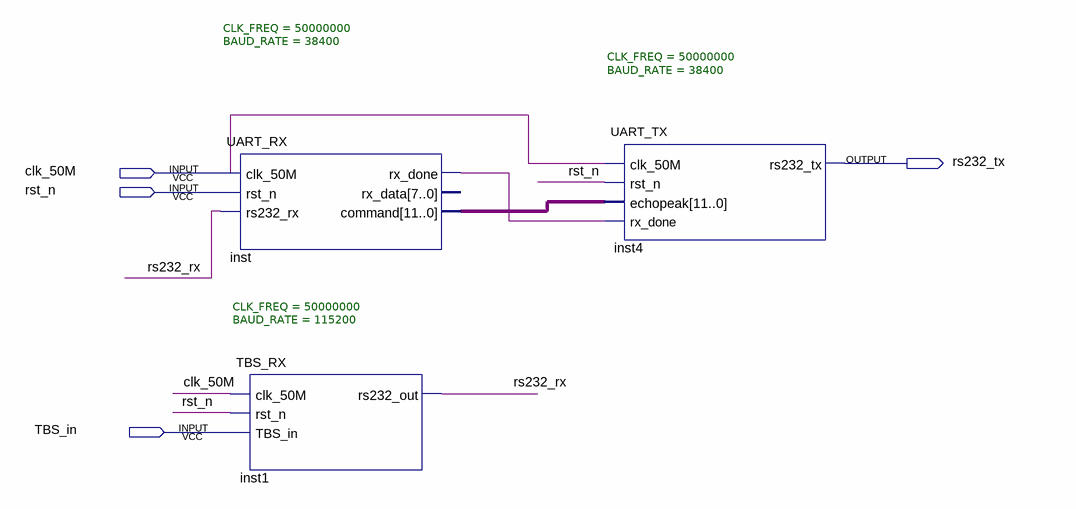
[diagram p0: schematic sheet]
// Quartus schematic TBS_RS232_RX.bdf as structural Verilog: 3 symbols, 4 pins
module TBS_RS232_RX (
  input  clk_50M,
  input  rst_n,
  input  TBS_in,
  output rs232_tx
);

  wire inst_rx_done, rs232_rx;
  wire [11:0] inst_command;

  UART_RX #(.CLK_FREQ(50000000), .BAUD_RATE(38400)) inst (
    .clk_50M(clk_50M), .rst_n(rst_n), .rs232_rx(rs232_rx), .rx_done(inst_rx_done), .command(inst_command));  // open: rx_data
  TBS_RX #(.CLK_FREQ(50000000), .BAUD_RATE(115200)) inst1 (
    .clk_50M(clk_50M), .rst_n(rst_n), .TBS_in(TBS_in), .rs232_out(rs232_rx));
  UART_TX #(.CLK_FREQ(50000000), .BAUD_RATE(38400)) inst4 (
    .clk_50M(clk_50M), .rst_n(rst_n), .echopeak(inst_command), .rx_done(inst_rx_done), .rs232_tx(rs232_tx));
endmodule
